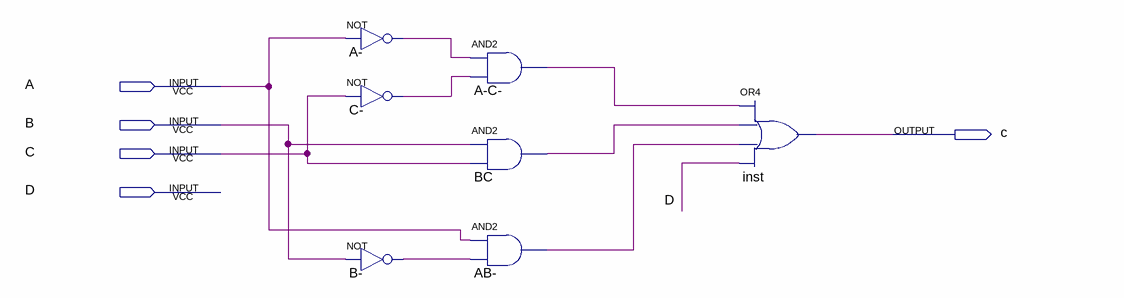
[diagram p0: schematic sheet]
// Quartus schematic c.bdf as structural Verilog: 7 symbols, 5 pins
module c (
  input  A,
  input  B,
  inout  C,
  input  D
);

  wire A__out, A_C__out, AB__out, B__out, BC_out, C__out;

  not \A-  (A__out, A);
  not \C-  (C__out, C);
  not \B-  (B__out, B);
  and \A-C-  (A_C__out, A__out, C__out);
  and BC (BC_out, B, C);
  and \AB-  (AB__out, A, B__out);
  or inst (C, A_C__out, BC_out, AB__out, D);
endmodule
